# EAGLE design NT_RadioModule_wurx (EAGLE 9.6.2)
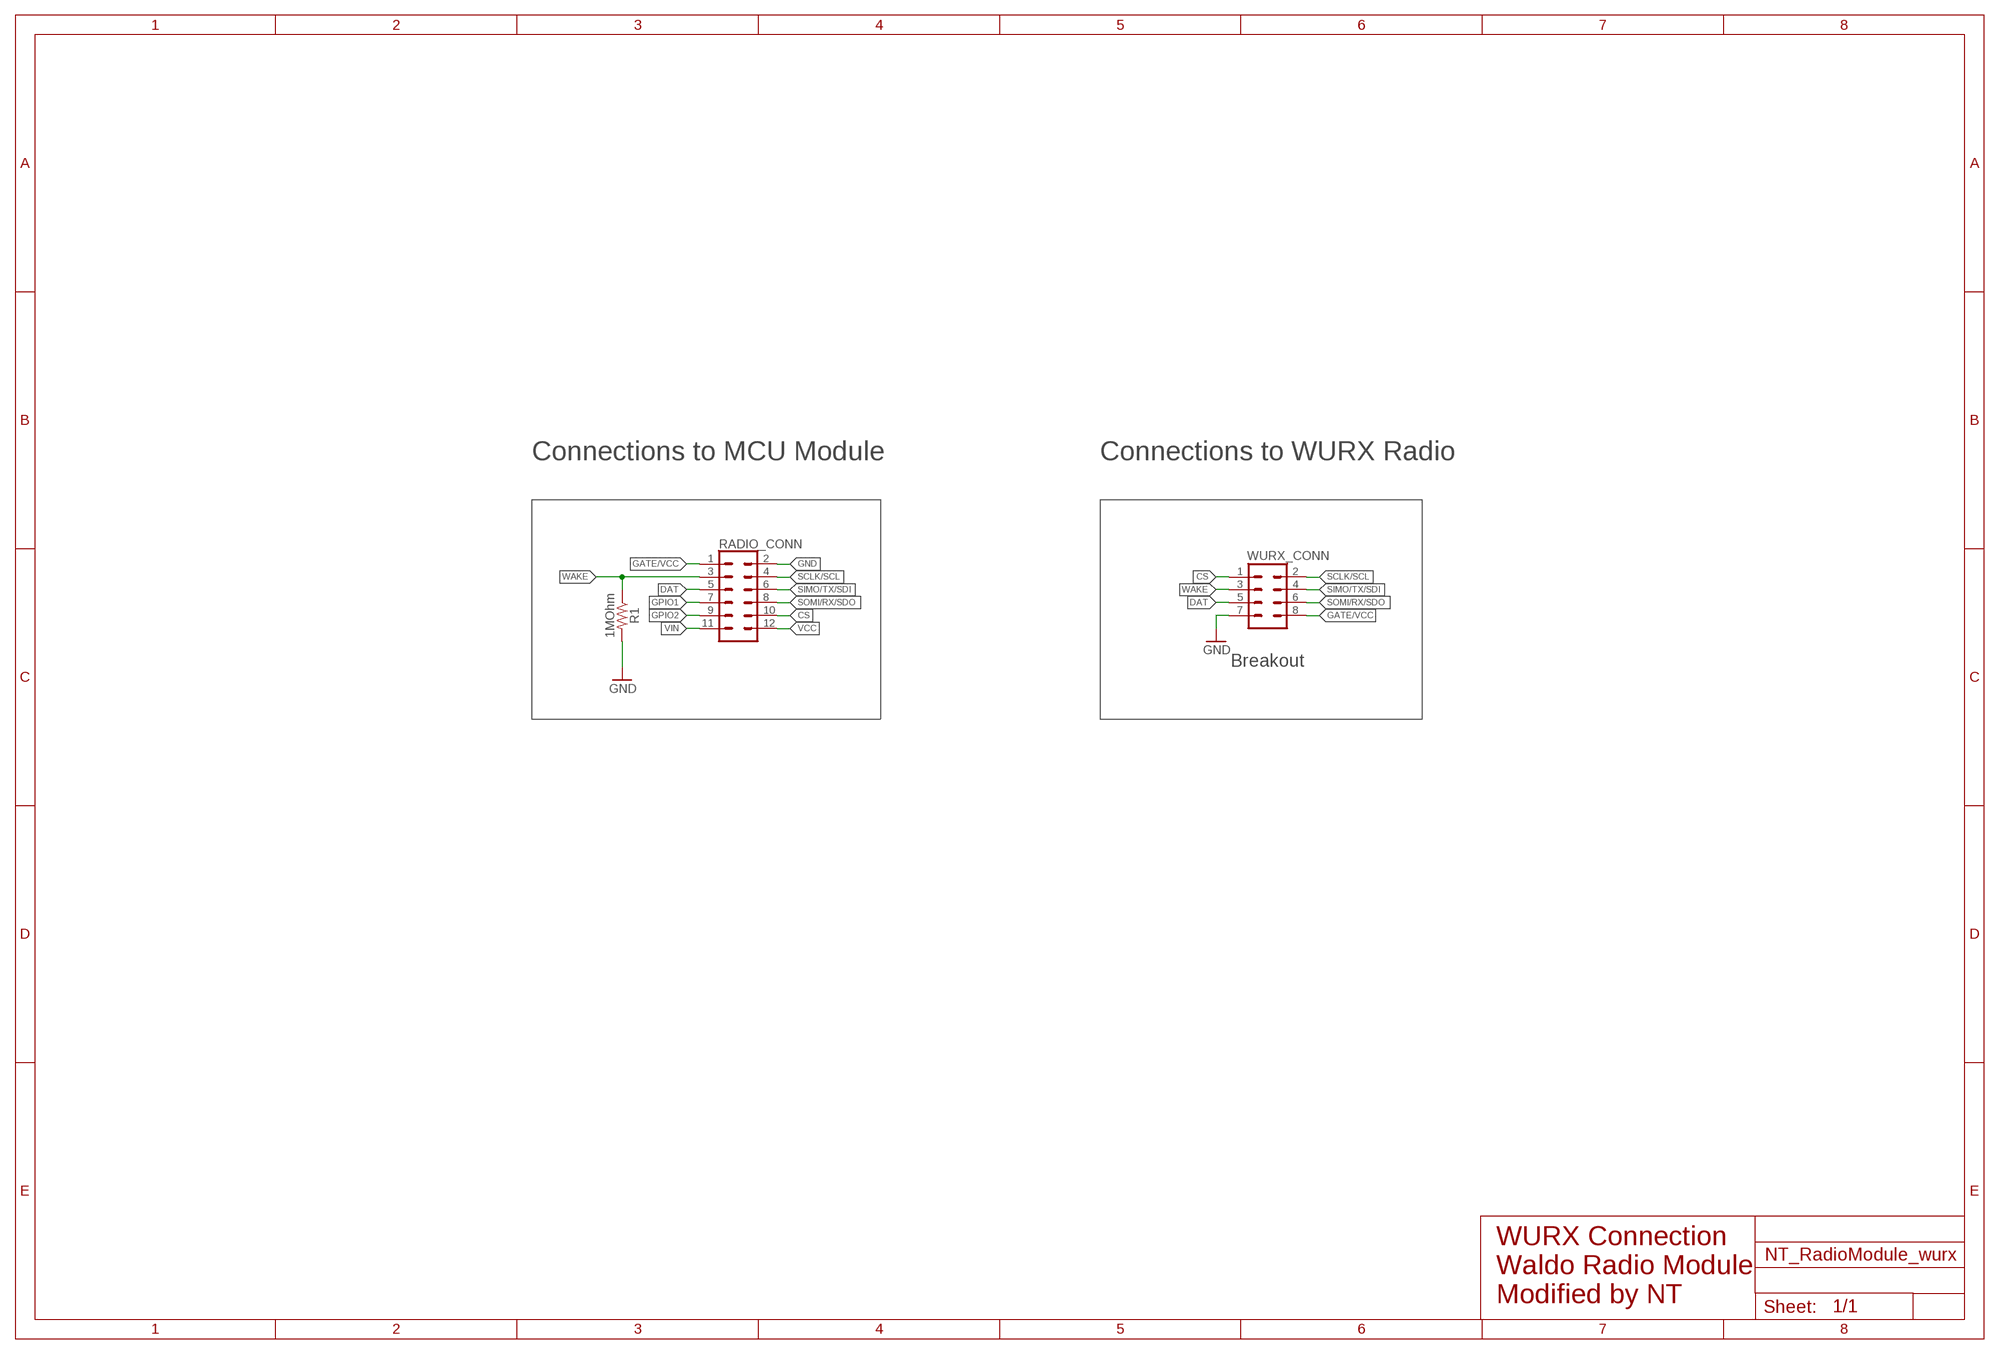
[diagram p0: schematic, sheet 1]

## Parts
R1  1MOhm  0.3OHM-0805-1/8W-1%  [0805]
RADIO_CONN  CONN_06X2PTH_FEMALE  [2X6]
WURX_CONN  M04X2  [2X4]

## Nets
CS: RADIO_CONN.10 WURX_CONN.1
DAT: RADIO_CONN.5 WURX_CONN.5
GATE/VCC: RADIO_CONN.1 WURX_CONN.8
GND: R1.2 RADIO_CONN.2 WURX_CONN.7
GPIO1: RADIO_CONN.7
GPIO2: RADIO_CONN.9
SCLK/SCL: RADIO_CONN.4 WURX_CONN.2
SIMO/TX/SDI: RADIO_CONN.6 WURX_CONN.4
SOMI/RX/SDO: RADIO_CONN.8 WURX_CONN.6
VCC: RADIO_CONN.12
VIN: RADIO_CONN.11
WAKE: R1.1 RADIO_CONN.3 WURX_CONN.3

## Notes on the sheet
- Connections to MCU Module | Connections to WURX Radio
- Breakout
- WURX Connection
  Waldo Radio Module
  Modified by NT

## Library data of the parts
R1 = SparkFun-Resistors:0.3OHM: 0.3Ω resistor A resistor is a passive two-terminal electrical component that implements electrical resistance as a circuit element. Resistors act to reduce current flow, and, at the same time, act to lower voltage levels within circuits. - Wikipedia; PROD_ID: RES-11622; VALUE: 0.3
RADIO_CONN = SparkFun-Connectors:CONN_06X2: Multi connection point. Often used as Generic Header-pin footprint for 0.1 inch spaced/style header connections On any of the 0.1 inch spaced packages, you can populate with these: Break Away Headers - Straight <https://www.sparkfun.com/products/116> (PRT-00116) Break Away Male Headers - Right Angle <https://www.sparkfun.com/products/553> (PRT-00553) Female Headers <https://www.sparkfun.com/products/115> (PRT-00115) Break Away Headers - Machine Pin <https://www.sparkfun.com/products/117> (PRT-00117) Break Away Female Headers - Swiss Machine Pin <https://www.sparkfun.com/products/743> (PRT-00743); PROD_ID: CONN-12423; VALUE: 2X6 FEMALE
WURX_CONN = SparkFun-Connectors:M04X2: .1" header, two rows of four.

## Board
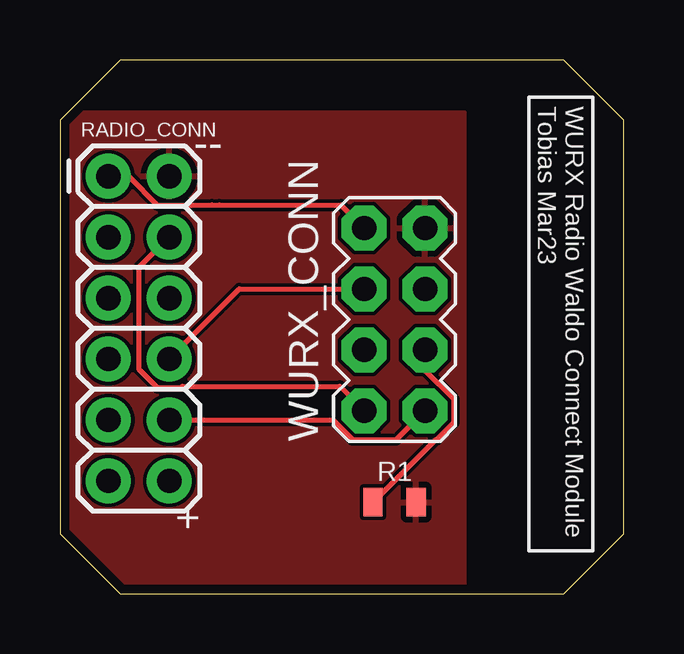
[diagram p1: board, top side]
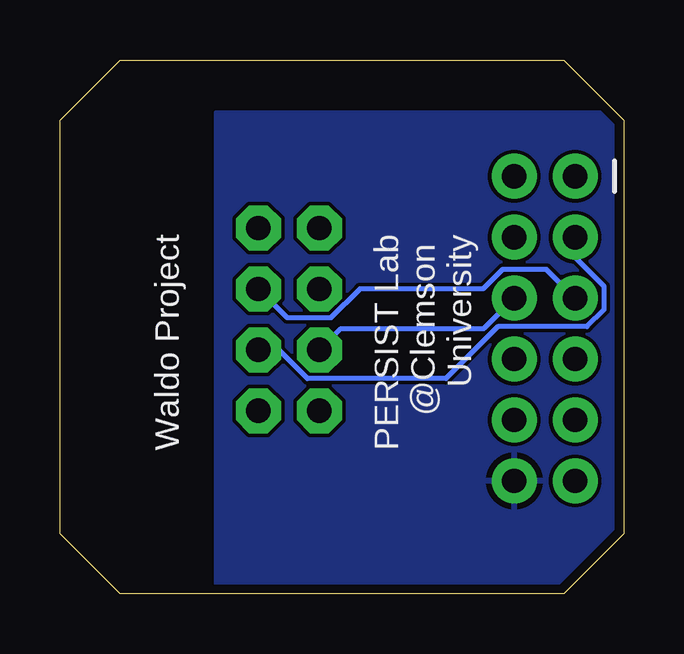
[diagram p2: board, bottom side, seen from below]

Size 23.5 x 22.25 mm. Coordinates in mm from the lower left corner, seen from the top.
Outline: 21,22.25 2.5,22.25 0,19.75 0,2.5 2.5,0 21,0 23.5,2.5 23.5,19.75 21,22.25
Copper layers (1*16): Top 0.0356mm / dielectric 1.5011mm / Bottom 0.0356mm
Design rules "oshpark-2layer *": minimum track width 6mil, minimum drill 13mil, track to track 6mil, track to pad 6mil, pad to pad 6mil, via to via 6mil, smd to smd 6mil, copper to edge 15mil, drill to drill 6mil, minimum pad ring 7mil, minimum via ring 7mil, stop-mask expansion 2.5mil, vias tented up to drill 14mil, thermal gap 10mil

### Footprints (pad centres in the part's own frame; a part is rotated, then mirrored left to right if it is on the bottom)
0805 = smd 0.8 x 1.2: 1 -0.9,0; 2 0.9,0
2X6 = drill 1.016 pad 1.88: 1 0,0; 2 0,2.54; 3 2.54,0; 4 2.54,2.54; 5 5.08,0; 6 5.08,2.54; 7 7.62,0; 8 7.62,2.54; 9 10.16,0; 10 10.16,2.54; 11 12.7,0; 12 12.7,2.54
2X4 = drill 1.016 pad 1.88 octagon: 1 -3.81,-1.27; 2 -3.81,1.27; 3 -1.27,-1.27; 4 -1.27,1.27; 5 1.27,-1.27; 6 1.27,1.27; 7 3.81,-1.27; 8 3.81,1.27

### Placement (x,y rotation side)
R1  13.95,3.81 0 top
RADIO_CONN  2.02,17.4 270 top
WURX_CONN  13.95,11.43 90 top

### Tracks (layer width: path | path; a pad name or v marks a point on that pad's centre or on a via)
CS
  Top 0.203: RADIO_CONN.10 11.38,7.24 12.19,6.43 14.03,6.43 WURX_CONN.1
DAT
  Bottom 0.203: RADIO_CONN.5 3.21,13.51 5.05,13.51 5.86,12.7 11,12.7 12.19,11.51 14.03,11.51 WURX_CONN.5
GATE/VCC
  Top 0.203: RADIO_CONN.1 2.87,17.4 4.06,16.2 6.33,16.2 6.64,16.2 11.72,16.2 WURX_CONN.8
GND
  pour Top: -3.83,20.07 16.88,20.07 16.88,-0.38 -3.83,-0.38
SCLK/SCL
  Top 0.203: RADIO_CONN.4 3.29,13.59 3.29,9.36 4.06,8.59 5.05,8.59 5.1,8.64 11.67,8.64 WURX_CONN.2
SIMO/TX/SDI
  Bottom 0.203: RADIO_CONN.6 5.83,11.05 11.79,11.05 WURX_CONN.4
SOMI/RX/SDO
  Top 0.203: RADIO_CONN.8 7.48,12.7 WURX_CONN.6
VCC
  pour Bottom: -6.37,20.07 17,20.07 17,-0.51 -6.37,-0.51
WAKE
  Top 0.203: WURX_CONN.3 15.22,9.31 16.42,8.11 16.42,7.13 15.72,6.43 15.67,6.43 R1.1
  Bottom 0.203: WURX_CONN.3 14.37,10.16 13.18,8.97 7.41,8.97 5.25,11.12 1.52,11.12 0.82,11.82 0.82,12.81 2.02,14.01 RADIO_CONN.3

### Text on the board
tPlace: WURX Radio Waldo Connect Module / Tobias Mar23 | -- | +
bPlace: Waldo Project / / / / / / PERSIST Lab / @Clemson / University